# Altium schematic sheet COVERSchDoc.SchDoc
size A3; ApprovedBy: Osman Altay; CheckedBy: Osman Altay; DrawnBy: Osman Altay; SheetNumber: 1; SheetTotal: 3; Department: R&D; Size: A3; change date: 02.09.2023; relase date: 02.11.2023; Description: Wifi Security Card
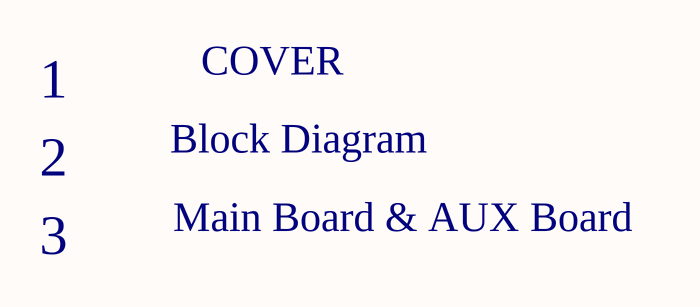
[diagram p0: COVERSchDoc.SchDoc]

## Notes on the sheet
- 1
- 2
- COVER
- Block Diagram
- 3
- Main Board & AUX Board
- İÇİNDEKİLER/CONTENTS
- REVİZYON/REVISION
- ÜRETİM NOTLARI/PRODUCTİON NOTES
- SAYFA NU.
- PAGE NO
- AÇIKLAMA/DESCRIPTION
- KART ÖZELLİKLERİ
- BOARD FEATURES
- ÜRETİM ÇIKTILARI
- GERBER FILES
- EKLER
- ATTACHMENTS
- İLETİŞİM/CONTACT
- FİLE NAME
- Text
- PREPARED BY
- DESCRIPTION
- RELASE DATE
- CHECKED BY
- APPROVED BY
- CHANGE DATE
- DEPARTMENT
- SIZE
- REVISION
- SHEET